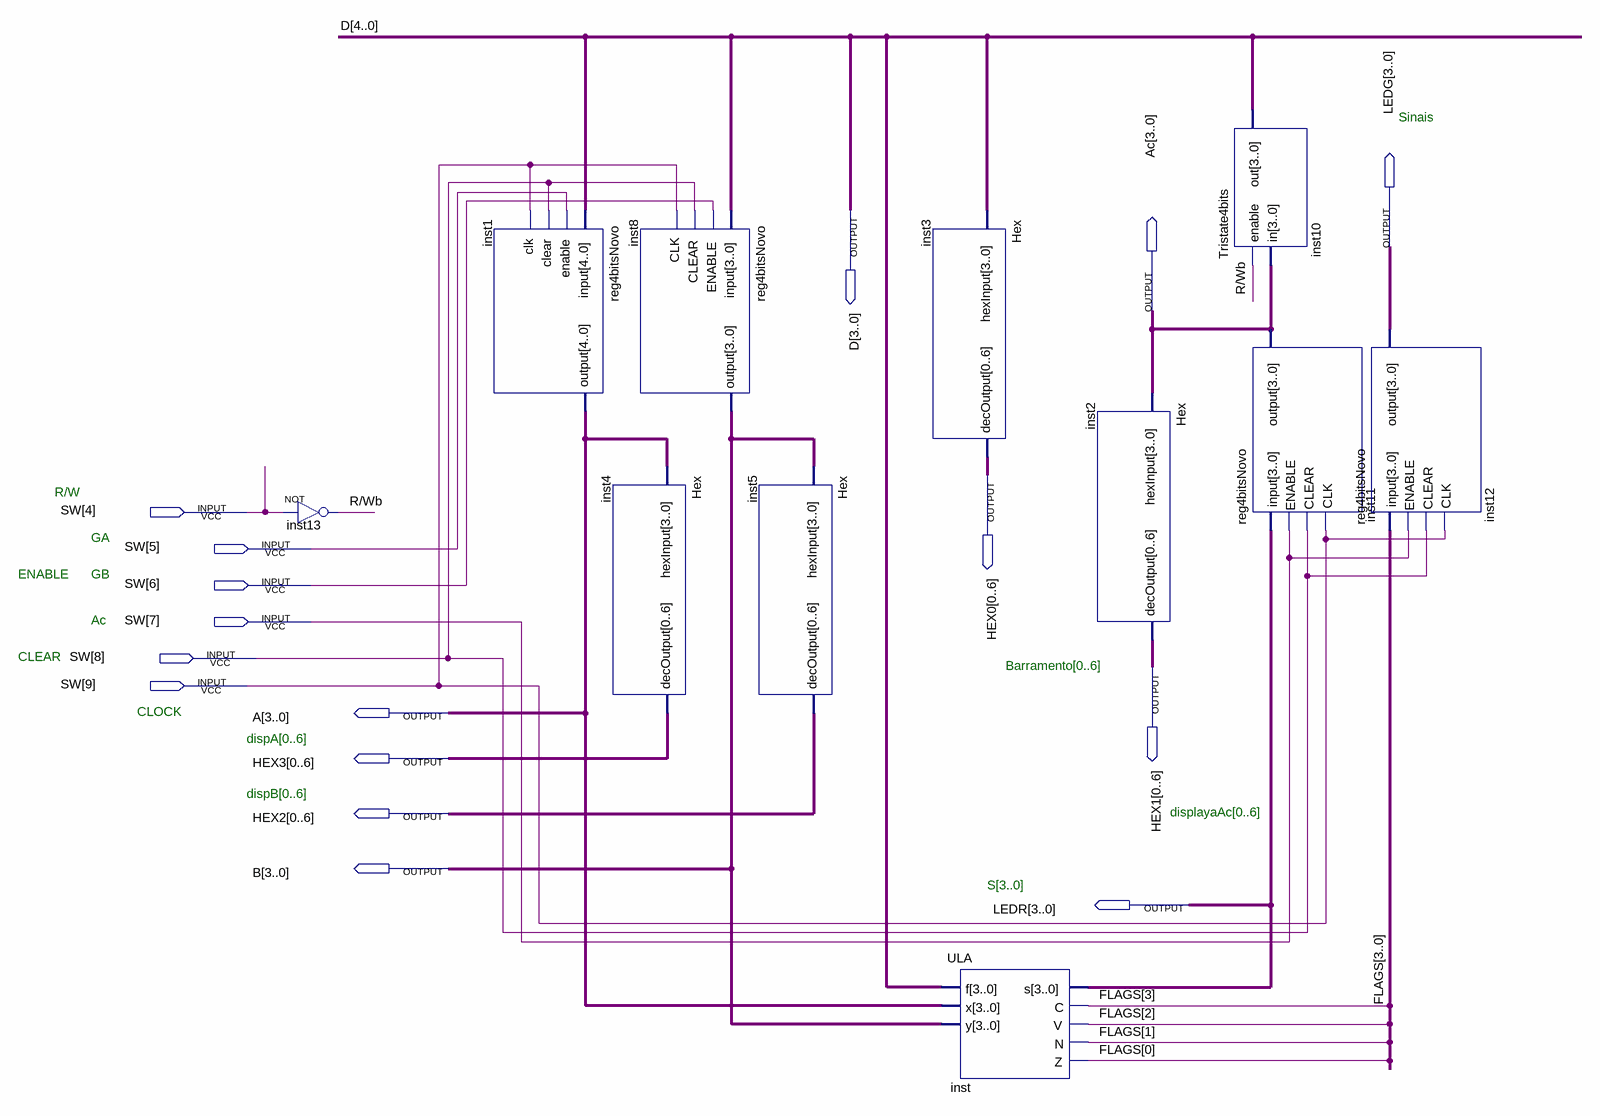
[diagram p0: schematic sheet]
// Quartus schematic CircuitoFinal.bdf as structural Verilog: 11 symbols, 16 pins
module CircuitoFinal (
  input  [9:4] SW,
  output [4:0] D,
  output [3:0] LEDG,
  output [3:0] Ac,
  output [0:6] HEX0,
  output [0:6] HEX1,
  output [3:0] A,
  output [0:6] HEX3,
  output [0:6] HEX2,
  output [3:0] B,
  output [3:0] LEDR
);

  wire \R/Wb ;
  wire [3:0] FLAGS;

  not inst13 (\R/Wb , SW[4]);
  reg4bitsNovo inst1 (.\input (D), .enable(SW[5]), .clear(SW[8]), .clk(SW[9]), .\output (A));
  reg4bitsNovo inst8 (.\input (D), .ENABLE(SW[6]), .CLEAR(SW[8]), .CLK(SW[9]), .\output (B));
  Hex inst4 (.hexInput(A), .decOutput(HEX3));
  Hex inst5 (.hexInput(B), .decOutput(HEX2));
  Hex inst3 (.hexInput(D), .decOutput(HEX0));
  ULA inst (.f(D), .x(A), .y(B), .s(LEDR), .C(FLAGS[3]), .V(FLAGS[2]), .N(FLAGS[1]), .Z(FLAGS[0]));
  Hex inst2 (.hexInput(Ac), .decOutput(HEX1));
  Tristate4bits inst10 (.enable(\R/Wb ), .in(Ac), .out(D));
  reg4bitsNovo inst11 (.\input (LEDR), .ENABLE(SW[7]), .CLEAR(SW[8]), .CLK(SW[9]), .\output (Ac));
  reg4bitsNovo inst12 (.\input (FLAGS), .ENABLE(SW[7]), .CLEAR(SW[8]), .CLK(SW[9]), .\output (LEDG));

  // Notes on the sheet:
  //   Sinais
  //   R/W
  //   GA
  //   ENABLE
  //   GB
  //   Ac
  //   CLEAR
  //   Barramento[0..6]
  //   CLOCK
  //   dispA[0..6]
  //   dispB[0..6]
  //   displayaAc[0..6]
  //   S[3..0]
endmodule
